# Altium schematic sheet USB.SchDoc
size A4
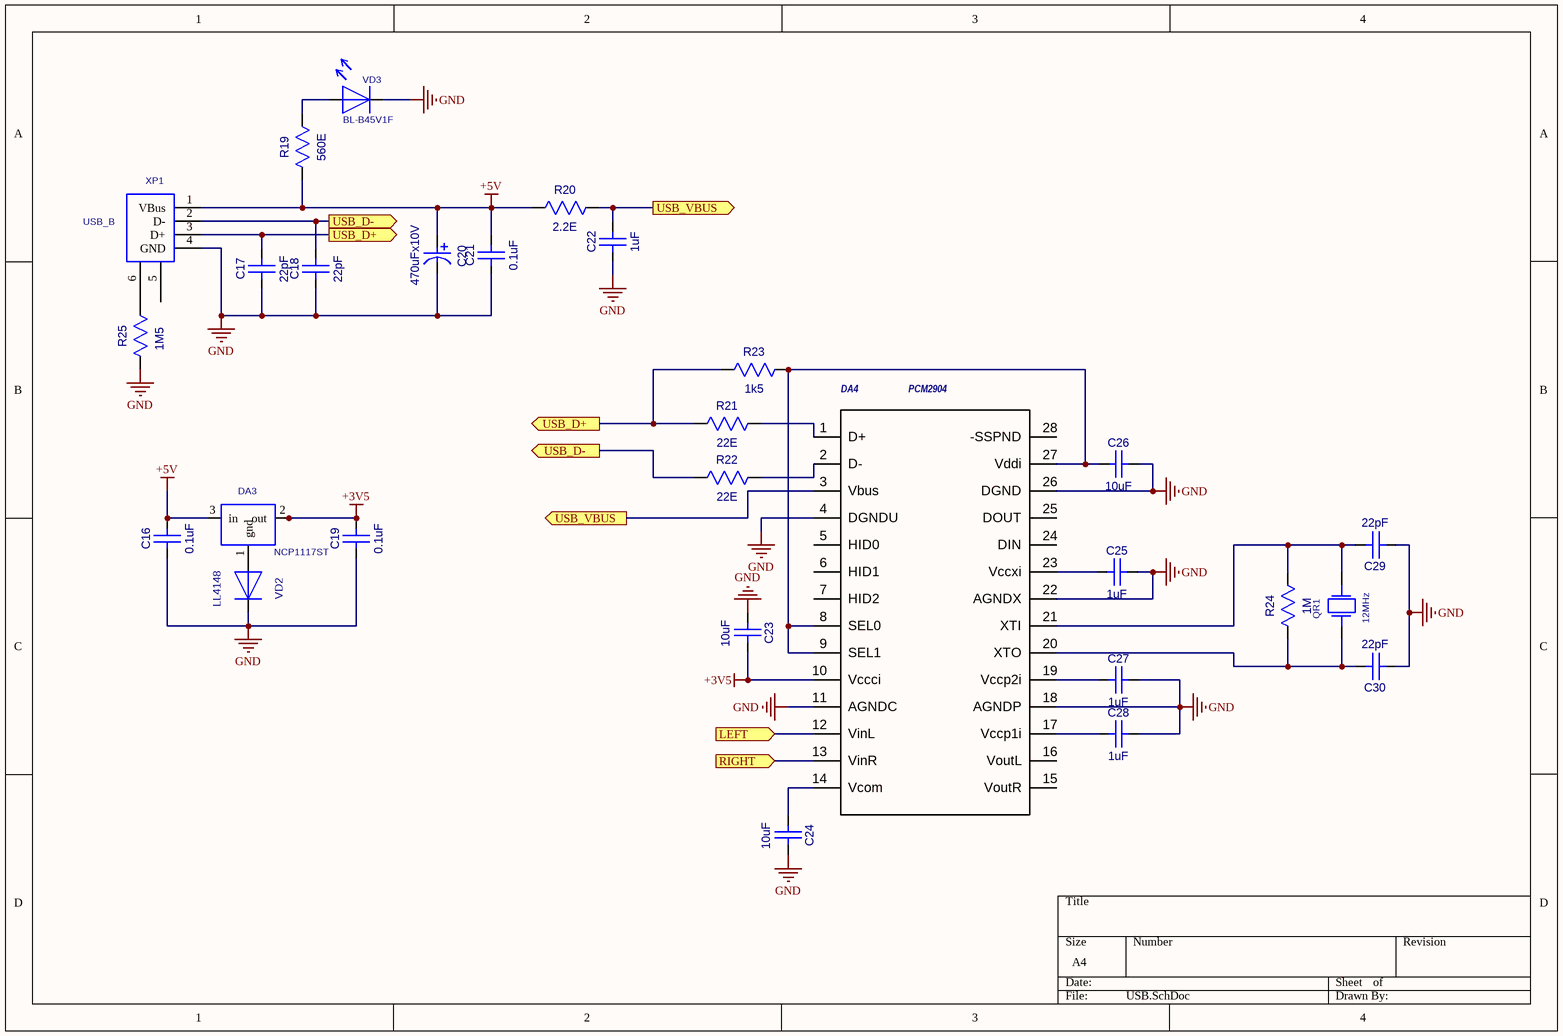
[diagram p0: USB.SchDoc]

## Parts
C16  0.1uF  [CC0603-3M]
C17  22pF  [CC0603-3M]
C18  22pF  [CC0603-3M]
C19  0.1uF  [CC0603-3M]
C20  470uFx10V  [CC8X3.5]
C21  0.1uF  [CC0603-3M]
C22  1uF  [CC0603-3M]
C23  10uF  [CC0805-MIDI-2M1]
C24  10uF  [CC0805-MIDI-2M1]
C25  1uF  [CC0603-3M]
C26  10uF  [CC0805-MIDI-2M1]
C27  1uF  [CC0603-3M]
C28  1uF  [CC0603-3M]
C29  22pF  [CC0603-3M]
C30  22pF  [CC0603-3M]
DA3  NCP1117ST  [SOT-223]
DA4  PCM2904  [TSSOP28]
QR1  12MHz  [HC-49]
R19  560E  [RC0603-3M]
R20  2.2E  [RC0805_IPC_NOM]
R21  22E  [RC0603-3M]
R22  22E  [RC0603-3M]
R23  1k5  [RC0603-3M]
R24  1M  [RC0603-3M]
R25  1M5  [RC1206-2M]
VD2  LL4148  [SOD-80]
VD3  BL-B45V1F  [LED3]
XP1  USB_B  [USB-B]

## Ports
LEFT (in), RIGHT (in), USB_D+ (out), USB_D- (out), USB_VBUS (out)

## Nets
+3V5: C19.2(B) C23.2(B) DA3.2(out) DA3.4 DA4.10(Vccci)
+5V: C16.2(B) C20.1 C21.2(B) DA3.3(in) R19.1(A) R20.1(A) XP1.1(VBus)
GND: C16.1(A) C17.1(A) C18.1(A) C19.1(A) C20.2 C21.1(A) C22.1(A) C23.1(A) C24.2(B) C25.2(B) C26.2(B) C27.2(B) C28.2(B) C29.1(A) C30.1(A) DA4.4(DGNDU) DA4.11(AGNDC) DA4.18(AGNDP) DA4.22(AGNDX) DA4.26(DGND) R25.1(A) VD2.2(+) VD3.1 XP1.4(GND)
LEFT: DA4.12(VinL) ; port LEFT
RIGHT: DA4.13(VinR) ; port RIGHT
USB_D+: C17.2(B) R21.1(A) R23.1(A) XP1.3(D+) ; port USB_D+
USB_D-: C18.2(B) R22.1(A) XP1.2(D-) ; port USB_D-
USB_VBUS: C22.2(B) DA4.3(Vbus) R20.2(B) ; port USB_VBUS
NetC24_1: C24.1(A) DA4.14(Vcom)
NetC25_1: C25.1(A) DA4.23(Vccxi)
NetC26_1: C26.1(A) DA4.8(SEL0) DA4.9(SEL1) DA4.27(Vddi) R23.2(B)
NetC27_1: C27.1(A) DA4.19(Vccp2i)
NetC28_1: C28.1(A) DA4.17(Vccp1i)
NetC29_2: C29.2(B) DA4.21(XTI) QR1.2 R24.2(B)
NetC30_2: C30.2(B) DA4.20(XTO) QR1.1 R24.1(A)
NetDA3_1: DA3.1(gnd) VD2.1(-)
NetDA4_1: DA4.1(D+) R21.2(B)
NetDA4_2: DA4.2(D-) R22.2(B)
NetR19_2: R19.2(B) VD3.2
NetR25_2: R25.2(B) XP1.6

Not connected (* = marked no-connect by the designer): DA4 5(HID0) 6(HID1) 7(HID2) 15(VoutR) 16(VoutL) 24(DIN) 25(DOUT) 28(-SSPND); XP1 5

## Library data of the parts
C16-C19 C21 C22 C25 C27-C30 = CC0603
  C16 C19 C21: Value: 0.1uF
  C17 C18 C29 C30: Value: 22pF
  C22 C25 C27 C28: Value: 1uF
C20 = CAP0.35: Value: 470uFx10V
C23 C24 C26 = CC0805: Value: 10uF
QR1 = LP-3.5: Value: 12MHz
R19 R21-R24 = RC0603
  R19: Value: 560E
  R21 R22: Value: 22E
  R23: Value: 1k5
  R24: Value: 1M
R20 = RC0805: Value: 2.2E
R25 = RC1206: Value: 1M5
VD3 = LED_3: Value: BL-B45V1F
DA3 = NCP1117ST: Value: *
DA4 = PCM2904: Value: *
VD2 = LL4148: Value: *
XP1 = USB_B: Value: *